# Altium schematic sheet GEX_IDC.rev2.SchDoc: GEX IDC breakout
size A4; Author: Ondřej Hruška; CompanyName: FEE CTU Prague; Revision: 2; PageSetup: Record=PageOptions|CenterHorizontal=True|CenterVertical=True|PrintScale=1.00|XCorrection=1.00|YCorrection=1.00|PrintKind=1|BorderSize=5000000|LeftOffset=0|BottomOffset=0|Orientation=2|PaperLength=1000|PaperWidth=1000|Scale=100|PaperSource=7|PrintQuality=600|MediaType=1|DitherType=10|PrintScaleMode=1|PaperKind=A4|PaperIndex=9; CurrentDate: 15 Apr 2018
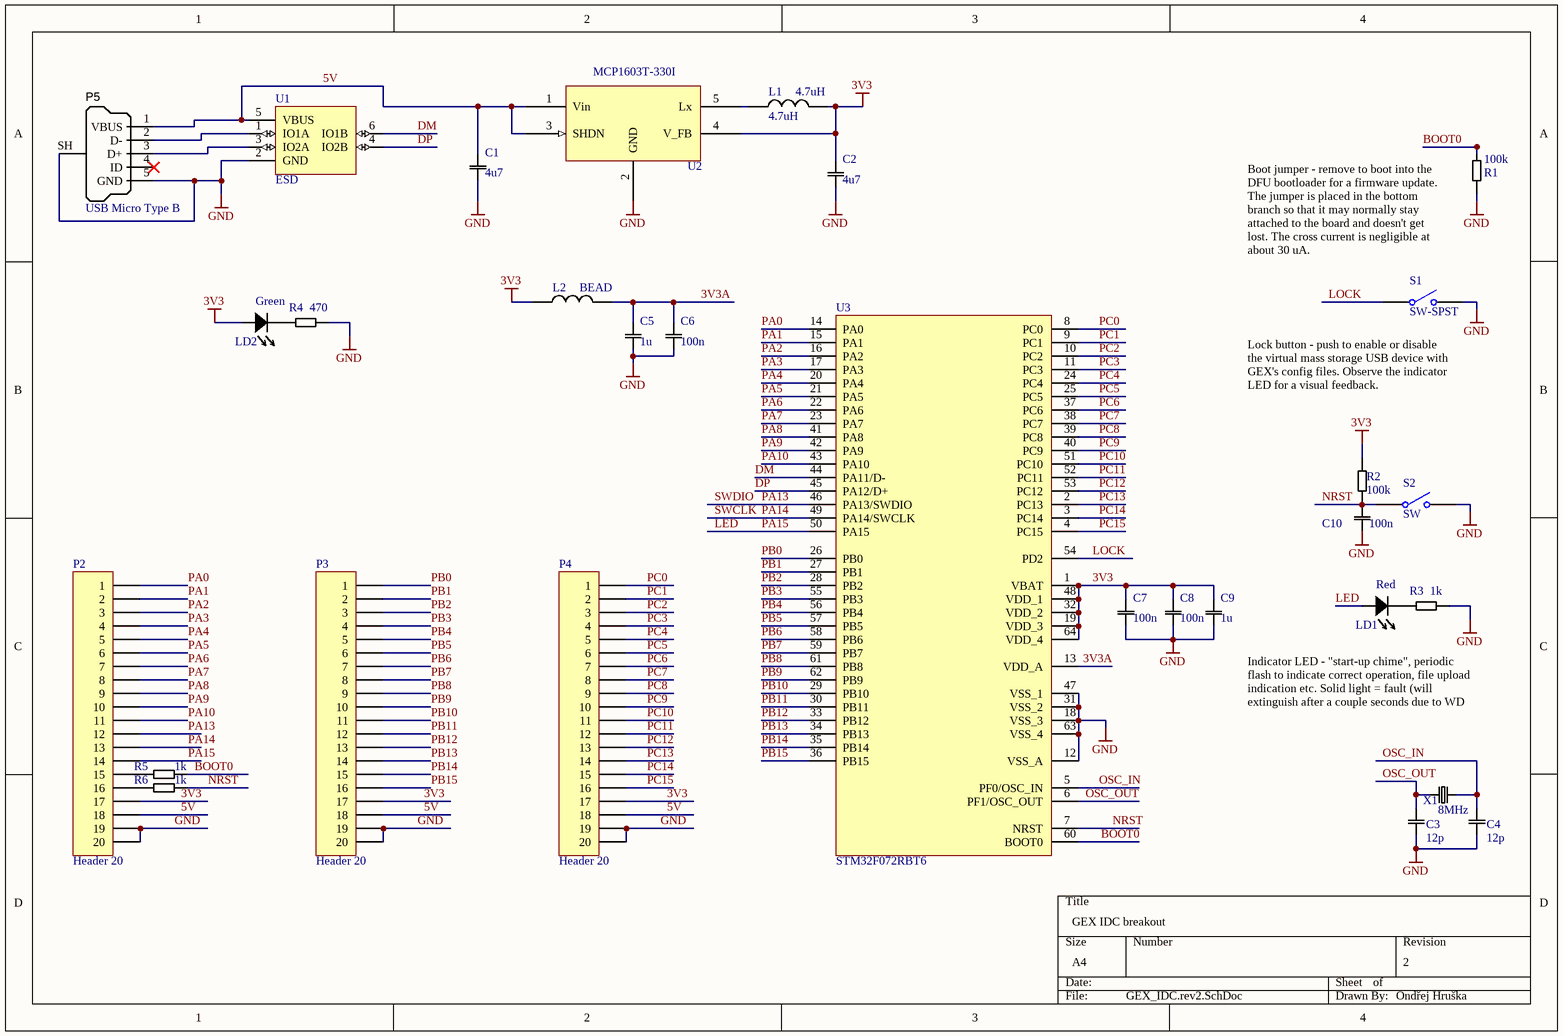
[diagram p0: GEX_IDC.rev2.SchDoc]

## Parts
C1  4u7  [C1206]
C2  4u7  [C1206]
C3  12p  [C0805]
C4  12p  [C0805]
C5  1u  [C0805]
C6  100n  [C0805]
C7  100n  [C0805]
C8  100n  [C0805]
C9  1u  [C0805]
C10  100n  [C0805]
L1  4.7uH  [L_3x3]
L2  BEAD  [R0805]
LD1  Red  [LED_SMD]
LD2  Green  [LED_SMD]
P2  Header 20  [MLW20_GEX_14]
P3  Header 20  [MLW20_GEX_16]
P4  Header 20  [MLW20_GEX_16]
P5  value USB Micro Type B  [USB_Micro-B_AFCI_10118194]  (hidden comment: USB_Micro_TypeB_Molex_105017)
R1  100k  [R0805]
R2  100k  [R0805]
R3  1k  [R0805]
R4  470  [R0805]
R5  1k  [R0805]
R6  1k  [R0805]
S1  SW-SPST  [BTN_AJ050]
S2  SW  [SW_TINY_4PAD]
U1  ESD  [SOT23-6]
U2  MCP1603T-330I  [SOT23-5]
U3  STM32F072RBT6  [LQFP64]
X1  8MHz  [XTAL-SMD-50-32]

## Nets
3V3: C2.2 C7.2 C8.2 C9.2 L1.2 L2.1 LD2.A P2.17 P3.17 P4.17 R2.1 U2.4(V_FB) U3.1(VBAT) U3.19(VDD_3) U3.32(VDD_2) U3.48(VDD_1) U3.64(VDD_4)
GND: C1.1 C2.1 C3.1 C4.1 C5.1 C6.1 C7.1 C8.1 C9.1 C10.1 P2.19 P2.20 P3.19 P3.20 P4.19 P4.20 P5.5(GND) P5.SH(Shell) R1.2 R3.1 R4.1 S1.2(NO) S2.2(NO) U1.2(GND) U2.2(GND) U3.12(VSS_A) U3.18(VSS_3) U3.31(VSS_2) U3.47(VSS_1) U3.63(VSS_4)
3V3A: C5.2 C6.2 L2.2 U3.13(VDD_A)
5V: C1.2 P2.18 P3.18 P4.18 P5.1(VBUS) U1.5(VBUS) U2.1(Vin) U2.3(SHDN)
BOOT0: R1.1 R5.1 U3.60(BOOT0)
DM: U1.6(IO1B) U3.44(PA11/D-)
DP: U1.4(IO2B) U3.45(PA12/D+)
LED: LD1.A P2.14 U3.50(PA15)  [also labelled PA15]
LOCK: S1.1(COMMON) U3.54(PD2)
NRST: C10.2 R2.2 R6.1 S2.1(COMMON) U3.7(NRST)
OSC_IN: C4.2 U3.5(PF0/OSC_IN) X1.2
OSC_OUT: C3.2 U3.6(PF1/OSC_OUT) X1.1
PA0: P2.1 U3.14(PA0)
PA1: P2.2 U3.15(PA1)
PA2: P2.3 U3.16(PA2)
PA3: P2.4 U3.17(PA3)
PA4: P2.5 U3.20(PA4)
PA5: P2.6 U3.21(PA5)
PA6: P2.7 U3.22(PA6)
PA7: P2.8 U3.23(PA7)
PA8: P2.9 U3.41(PA8)
PA9: P2.10 U3.42(PA9)
PA10: P2.11 U3.43(PA10)
PA13: P2.12 U3.46(PA13/SWDIO)  [also labelled SWDIO]
PA14: P2.13 U3.49(PA14/SWCLK)  [also labelled SWCLK]
PB0: P3.1 U3.26(PB0)
PB1: P3.2 U3.27(PB1)
PB2: P3.3 U3.28(PB2)
PB3: P3.4 U3.55(PB3)
PB4: P3.5 U3.56(PB4)
PB5: P3.6 U3.57(PB5)
PB6: P3.7 U3.58(PB6)
PB7: P3.8 U3.59(PB7)
PB8: P3.9 U3.61(PB8)
PB9: P3.10 U3.62(PB9)
PB10: P3.11 U3.29(PB10)
PB11: P3.12 U3.30(PB11)
PB12: P3.13 U3.33(PB12)
PB13: P3.14 U3.34(PB13)
PB14: P3.15 U3.35(PB14)
PB15: P3.16 U3.36(PB15)
PC0: P4.1 U3.8(PC0)
PC1: P4.2 U3.9(PC1)
PC2: P4.3 U3.10(PC2)
PC3: P4.4 U3.11(PC3)
PC4: P4.5 U3.24(PC4)
PC5: P4.6 U3.25(PC5)
PC6: P4.7 U3.37(PC6)
PC7: P4.8 U3.38(PC7)
PC8: P4.9 U3.39(PC8)
PC9: P4.10 U3.40(PC9)
PC10: P4.11 U3.51(PC10)
PC11: P4.12 U3.52(PC11)
PC12: P4.13 U3.53(PC12)
PC13: P4.14 U3.2(PC13)
PC14: P4.15 U3.3(PC14)
PC15: P4.16 U3.4(PC15)
NetL1_1: L1.1 U2.5(Lx)
NetLD1_C: LD1.C R3.2
NetLD2_C: LD2.C R4.2
NetP2_15: P2.15 R5.2
NetP2_16: P2.16 R6.2
NetP5_2: P5.2(D-) U1.1(IO1A)
NetP5_3: P5.3(D+) U1.3(IO2A)

Not connected (* = marked no-connect by the designer): P5 4(ID)*

## Notes on the sheet
- Boot jumper - remove to boot into the DFU bootloader for a firmware update. The jumper is placed in the bottom branch so that it may normally stay attached to the board and doesn't get lost. The cross current is negligible at about 30 uA.
- (near S1) Lock button - push to enable or disable the virtual mass storage USB device with GEX's config files. Observe the indicator LED for a visual feedback.
- Indicator LED - "start-up chime", periodic flash to indicate correct operation, file upload indication etc. Solid light = fault (will extinguish after a couple seconds due to WD reset)

## Library data of the parts
C1-C10 = C: Supplier 1: Farnell
  C1 C2: Value: 4u7
  C3 C4: Supplier Part Number 1: any C0805 X7R 50V; Value: 12p
  C5 C9: Value: 1u
  C6-C8 C10: Value: 100n
L1 = L: Inductor; Part number: VLS3015ET-4R7M; Value: 4.7uH
L2 = L: Inductor
LD1 LD2 = LED: Value: TBD
P2-P4 = Header 20: Header, 20-Pin; LatestRevisionDate: 17-Jul-2002; LatestRevisionNote: Re-released for DXP Platform.; Publisher: Altium Limited
P5 = USB_Micro_TypeB_Molex_105017: Connector SMD USB Micro Type B bottom mount, (recommended if hand soldering); Model: USB Micro Type B (recommended if hand soldering); Package / Case: SMD/THD mid-mount; Supplier 1: Farnell; Supplier Part Number 1: 2293836
R1-R6 = R: Supplier Part Number 1: any R0805 1%; Supplier 1: Farnell
  R1 R2: Value: 100k
  R3 R5 R6: Value: 1k
  R4: Value: 470
S1 = SW-SPST: Single-Pole, Single-Throw Switch; Published: 24-Mar-1999; LatestRevisionDate: 17-Jul-2002; LatestRevisionNote: Re-released for DXP Platform.; PackageReference: SPST-2; Publisher: Altium Limited; PackageDescription: Switch; 2 Leads
S2 = SW_SPST_4PAD
U1 = USBLC6_ESD
U2 = MCP1603
X1 = XTALL: Value: 8MHz